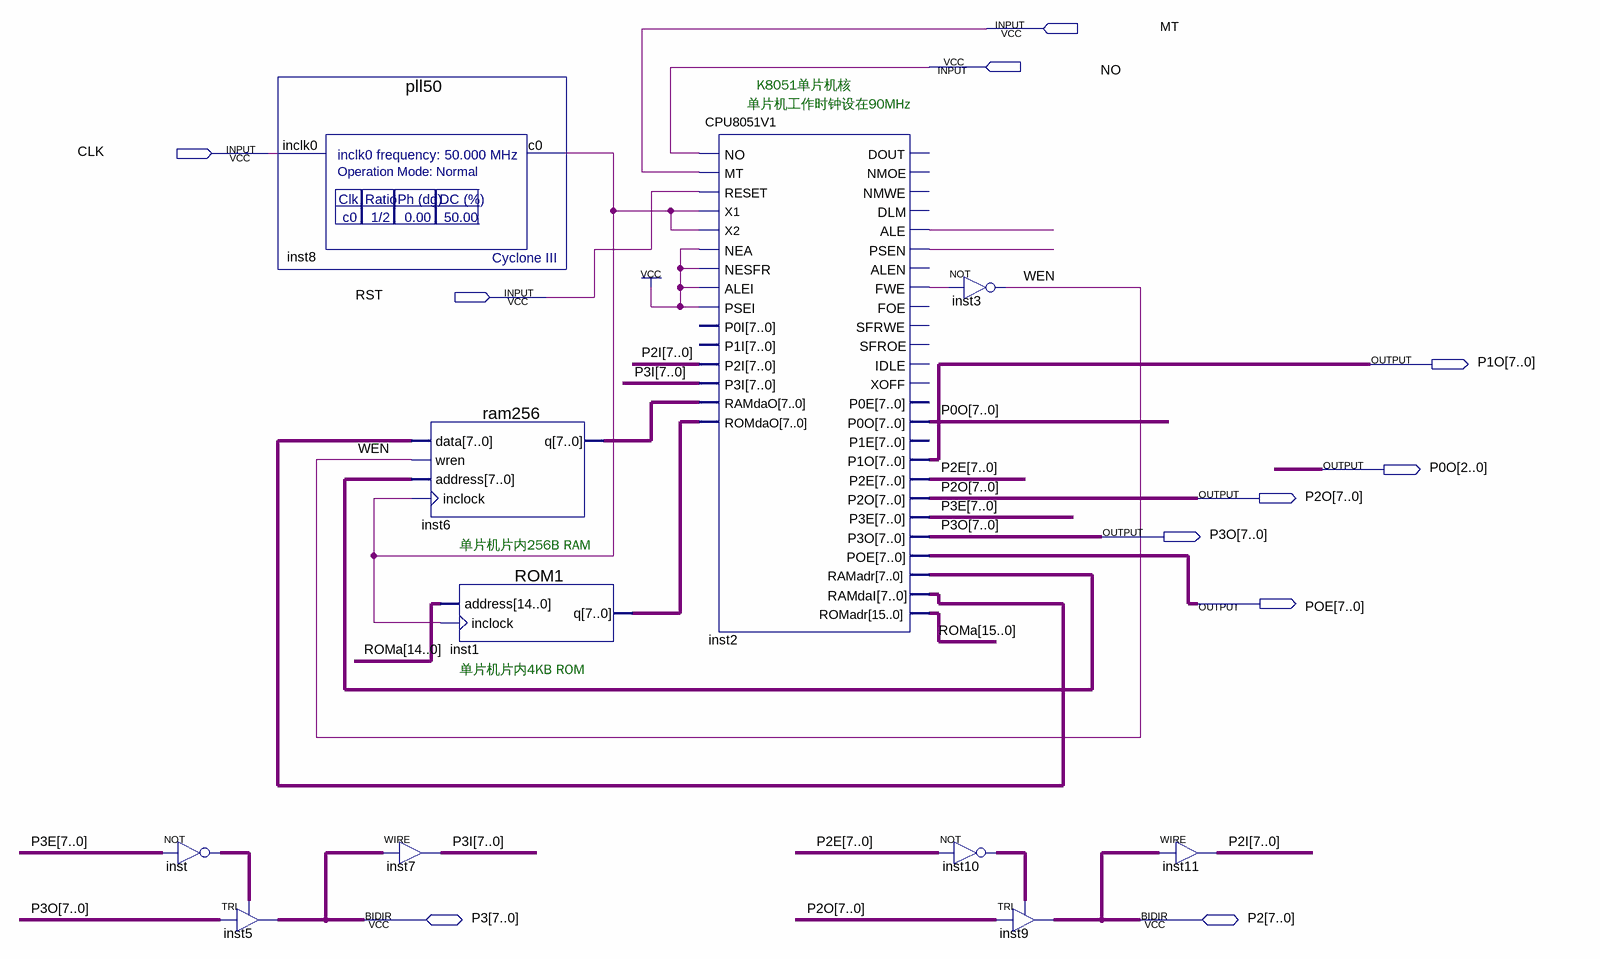
[diagram p0: schematic sheet]
// Quartus schematic MCU8951.bdf as structural Verilog: 11 symbols, 11 pins
module MCU8951 (
  input  MT,
  input  NO,
  input  CLK,
  input  RST,
  inout  [7:0] P3,
  inout  [7:0] P2,
  output [7:0] P1O,
  output [7:0] P0O,
  output [7:0] P2O,
  output [7:0] P3O,
  output [7:0] POE
);

  wire inst2_ale, inst2_fwe, inst2_psen, inst8_c0, WEN;
  wire [7:0] inst1_q, inst2_ramadr, inst2_ramdai, inst6_q, inst10_out, inst_out, P2E, P2I, P3E, P3I;
  wire [15:0] ROMa;

  assign inst_out = ~P3E;  // NOT inst, 8 bits wide
  TRI inst5[7:0] (.IN(P3O), .OE(inst_out), .OUT(P3));
  pll50 inst8 (.inclk0(CLK), .c0(inst8_c0));
  ram256 inst6 (.data(inst2_ramdai), .wren(WEN), .address(inst2_ramadr), .inclock(inst8_c0), .q(inst6_q));
  ROM1 inst1 (.address(ROMa[14:0]), .inclock(inst8_c0), .q(inst1_q));
  assign P3I = P3;  // WIRE inst7
  CPU8051V1 inst2 (
    .NO(NO), .MT(MT), .RESET(RST), .X1(inst8_c0), .X2(inst8_c0), .NEA(1'b1), .NESFR(1'b1), .ALEI(1'b1),
    .PSEI(1'b1), .P2I(P2I), .P3I(P3I), .RAMdaO(inst6_q), .ROMdaO(inst1_q), .ALE(inst2_ale),
    .PSEN(inst2_psen), .FWE(inst2_fwe), .P0O(P0O), .P1O(P1O), .P2E(P2E), .P2O(P2O), .P3E(P3E), .P3O(P3O),
    .POE(POE), .RAMadr(inst2_ramadr), .RAMdaI(inst2_ramdai), .ROMadr(ROMa));  // open: P0I, P1I, DOUT, NMOE, NMWE, DLM, ALEN, FOE, SFRWE, SFROE, IDLE, XOFF, P0E, P1E
  not inst3 (WEN, inst2_fwe);
  assign inst10_out = ~P2E;  // NOT inst10, 8 bits wide
  TRI inst9[7:0] (.IN(P2O), .OE(inst10_out), .OUT(P2));
  assign P2I = P2;  // WIRE inst11

  // Notes on the sheet:
  //   K8051单片机核
  //   单片机工作时钟设在90MHz
  //   单片机片内256B RAM
  //   单片机片内4KB ROM
endmodule
